# Altium project 电流环工程.PrjPCB
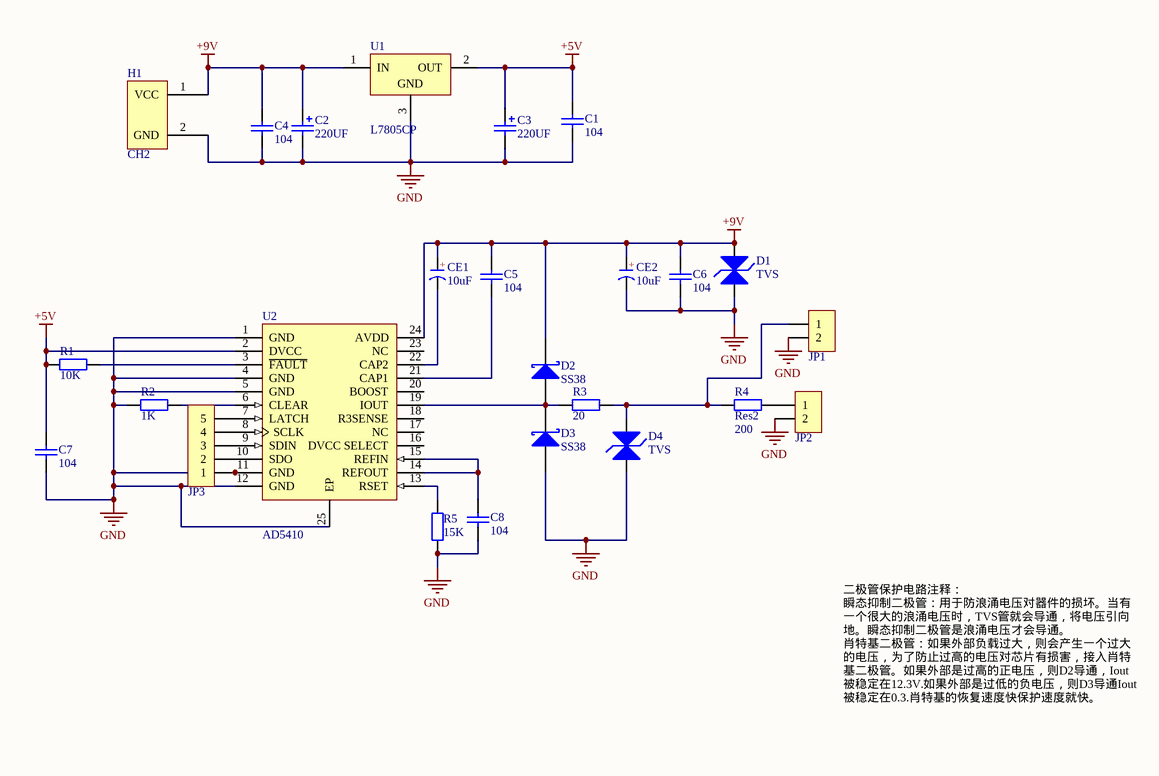
[diagram p0: 电流环原理图.SchDoc]
1 sheet, 25 parts. Net scope: global (net labels, ports and power ports of the same name join across sheets).
Board files: 电流环PCB.PcbDoc, 电流环打样板.PcbDoc

## Sheet 电流环原理图.SchDoc
size A4

### Parts
C1  104  [0805C]
C2  220UF  [220UF polar cap]
C3  220UF  [220UF polar cap]
C4  104  [0805C]
C5  104  [0805C]
C6  104  [0805C]
C7  104  [0805C]
C8  104  [0805C]
CE1  10uF  [C钽电容7mm*4mm]
CE2  10uF  [C钽电容7mm*4mm]
D1  TVS  [tvs]
D2  SS38  [SWB]
D3  SS38  [SWB]
D4  TVS  [tvs]
H1  CH2  [CH2座]
JP1  HDR-1X2  [HDR2.54-LI-2P]  (value not drawn)
JP2  HDR-1X2  [HDR2.54-LI-2P]  (value not drawn)
JP3  HDR-1X5  [XH2.54-LI-5P]  (value not drawn)
R1  10K  [0805R]
R2  1K  [0805R]
R3  20  [0805R]
R4  Res2  value 200  [AXIAL-0.4]
R5  15K  [0805R]
U1  L7805CP  [ISOWATT220AB]
U2  AD5410  [AD5410]

### Nets
+5V: C1.1 C3.1 C7.1 R1.1 U1.2(OUT) U2.2(DVCC)
+9V: C2.1 C4.1 C5.1 C6.1 CE1.1(A) CE2.1(A) D1.2(K) D2.2(K) H1.1(VCC) U1.1(IN) U2.24(AVDD)
GND: C1.2 C2.2 C3.2 C4.2 C6.2 C7.2 C8.2 CE2.2(K) D1.1(A) D3.1(A) D4.1(A) H1.2(GND) JP1.2 JP2.2 JP3.1 R2.1 R5.2 U1.3(GND) U2.1(GND) U2.4(GND) U2.5(GND) U2.11(GND) U2.12(GND) U2.25(EP)
NetC5_2: C5.2 U2.21(CAP1)
NetC8_1: C8.1 U2.14(REFOUT) U2.15(REFIN)
NetCE1_2: CE1.2(K) U2.22(CAP2)
NetD2_1: D2.1(A) D3.2(K) R3.1 U2.19(IOUT)
NetD4_2: D4.2(K) JP1.1 R3.2 R4.1
NetJP2_1: JP2.1 R4.2
NetJP3_2: JP3.2 U2.10(SDO)
NetJP3_3: JP3.3 U2.9(SDIN)
NetJP3_4: JP3.4 U2.8(SCLK)
NetJP3_5: JP3.5 U2.7(LATCH)
NetR1_2: R1.2 U2.3(~{FAULT})
NetR2_2: R2.2 U2.6(CLEAR)
NetR5_1: R5.1 U2.13(RSET)

Not connected (* = marked no-connect by the designer): U2 16(DVCC_SELECT) 17(NC) 18(R3SENSE) 20(BOOST) 23(NC)

### Notes on the sheet
- 二极管保护电路注释：
  瞬态抑制二极管：用于防浪涌电压对器件的损坏。当有一个很大的浪涌电压时，TVS管就会导通，将电压引向地。瞬态抑制二极管是浪涌电压才会导通。
  肖特基二极管：如果外部负载过大，则会产生一个过大的电压，为了防止过高的电压对芯片有损害，接入肖特基二极管。如果外部是过高的正电压，则D2导通，Iout被稳定在12.3V.如果外部是过低的负电压，则D3导通Iout被稳定在0.3.肖特基的恢复速度快保护速度就快。
- (in symbol CE) +

### Library data of the parts
C1 C4-C8 = cap: 非极性电容
C2 C3 = 220UF polar cap
CE1 CE2 = CE: 直插电解电容; 淘宝ID: 封装库来自淘宝 ID：黄晶宝石; BOM名称: 直插电解电容; 联系售后: https://shop463601444.taobao.com
D1 D4 = SMAJ26CA: 瞬态抑制二极管(TVS)
D2 D3 = SS34: 肖特基二极管
H1 = CH2座
JP1 JP2 = Header 2: 2P接插件; 版权归属: 封装库来自淘宝 ID：黄晶宝石; BOM名称: 2P接插件; 联系售后: https://shop463601444.taobao.com
JP3 = Header 5: 5P接插件; 版权归属: 封装库来自淘宝 ID：黄晶宝石; BOM名称: 5P接插件; 学习资源: https://shop463601444.taobao.com
R1-R3 R5 = 0805电阻
R4 = Res2: Resistor; Published: 8-Jun-2000; LatestRevisionDate: 17-Jul-2002; LatestRevisionNote: Re-released for DXP Platform.; PackageReference: AXIAL-0.4; Publisher: Altium Limited; PackageDescription: Axial Device, Thru-Hole; 2 Leads; 0.4 in Pin Spacing
U1 = L7805CP: Positive Voltage Regulator; Note: Tab is connected to pin 3 (GND).; Published: 24-Aug-2001; LatestRevisionDate: 17-Jul-2002; LatestRevisionNote: Re-released for DXP Platform.; DatasheetVersion: Dec-1998; PackageVersion: Jul-1998; PackageReference: ISOWATT220AB; Publisher: Altium Limited; PackageDescription: TO, Thru-Hole, Vertical, Heatsink Mounted; 3 In-Line Leads; Pitch 2.54 mm; Pin sequence 1, 3, 2; ComponentLink1Description: Manufacturer Link; ComponentLink1URL: http://www.st.com/
U2 = AD5410: 电流环芯片